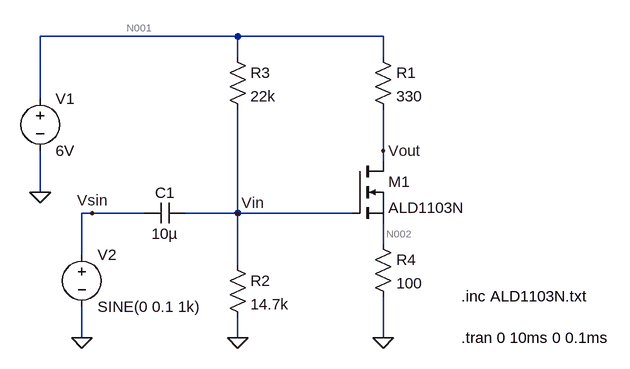
[diagram p0: schematic exp3.asc]
exp3.asc, the LTspice schematic file:
Version 4.1
SHEET 1 880 680
WIRE 176 -144 -128 -144
WIRE 400 -144 176 -144
WIRE 176 -112 176 -144
WIRE 400 -112 400 -144
WIRE -128 -48 -128 -144
WIRE 400 32 400 -32
WIRE 400 48 400 32
WIRE -128 96 -128 32
WIRE -48 128 -64 128
WIRE 32 128 -48 128
WIRE 176 128 176 -32
WIRE 176 128 96 128
WIRE 352 128 176 128
WIRE 400 176 400 144
WIRE -64 192 -64 128
WIRE 176 208 176 128
WIRE -64 320 -64 272
WIRE 176 320 176 288
WIRE 400 320 400 256
FLAG -64 320 0
FLAG 176 320 0
FLAG -128 96 0
FLAG 400 32 Vout
FLAG 176 128 Vin
FLAG -48 128 Vsin
FLAG 400 320 0
SYMBOL voltage -128 -64 R0
WINDOW 123 0 0 Left 0
WINDOW 39 0 0 Left 0
SYMATTR InstName V1
SYMATTR Value 6V
SYMBOL voltage -64 176 R0
WINDOW 123 0 0 Left 0
WINDOW 39 0 0 Left 0
SYMATTR InstName V2
SYMATTR Value SINE(0 0.1 1k)
SYMBOL cap 96 112 R90
WINDOW 0 0 32 VBottom 2
WINDOW 3 32 32 VTop 2
SYMATTR InstName C1
SYMATTR Value 10µ
SYMBOL res 384 -128 R0
SYMATTR InstName R1
SYMATTR Value 330
SYMBOL res 160 192 R0
SYMATTR InstName R2
SYMATTR Value 14.7k
SYMBOL res 160 -128 R0
SYMATTR InstName R3
SYMATTR Value 22k
SYMBOL nmos 352 48 R0
SYMATTR InstName M1
SYMATTR Value ALD1103N
SYMBOL res 384 160 R0
SYMATTR InstName R4
SYMATTR Value 100
TEXT 520 256 Left 2 !.inc ALD1103N.txt
TEXT 520 320 Left 2 !.tran 0 10ms 0 0.1ms

The netlist it stands for:
* exp3.asc
V1 N001 0 6V
V2 Vsin 0 SINE(0 0.1 1k)
C1 Vin Vsin 10µ
R1 N001 Vout 330
R2 Vin 0 14.7k
R3 N001 Vin 22k
M1 Vout Vin N002 N002 ALD1103N
R4 N002 0 100
.model NMOS NMOS
.model PMOS PMOS
.lib standard.mos
.inc ALD1103N.txt
.tran 0 10ms 0 0.1ms
.backanno
.end

* Results of the author's LTspice run, read from the files saved beside the schematic
* Operating Point, zero values left out:
*   V(vout) = 4.297 V
*   V(n002) = 516 mV
*   V(n001) = 6 V
*   V(vin) = 2.403 V
*   I(V1) = -5.323 mA
*   I(R2) = 163.5 µA
*   I(R3) = 163.5 µA
*   I(R4) = 5.16 mA
*   Id(M1) = 5.16 mA
*   Is(M1) = -5.16 mA
*   Ib(M1) = -3.793 pA
*   I(R1) = 5.16 mA
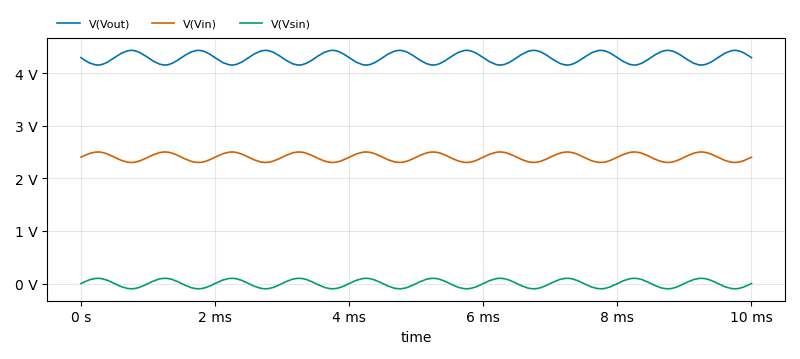
[diagram p1: Transient Analysis of exp3.asc, plotted from the saved traces]
* Transient Analysis, 1 run:
*   V(Vout): min 4.157 V, max 4.436 V, average 4.297 V, rms 4.298 V, last 4.297 V
*   V(Vin): min 2.303 V, max 2.503 V, average 2.403 V, rms 2.404 V, last 2.403 V
*   V(Vsin): min -100 mV, max 100 mV, average 11.6 µV, rms 71.65 mV, last 0 V